# Altium schematic sheet SnapItBreakoutRev1.SchDoc: Snap It Breakout
size A; Author: Callum Neely; DrawnBy: Callum Neely; Revision: 1; SheetNumber: 2; SheetTotal: 2
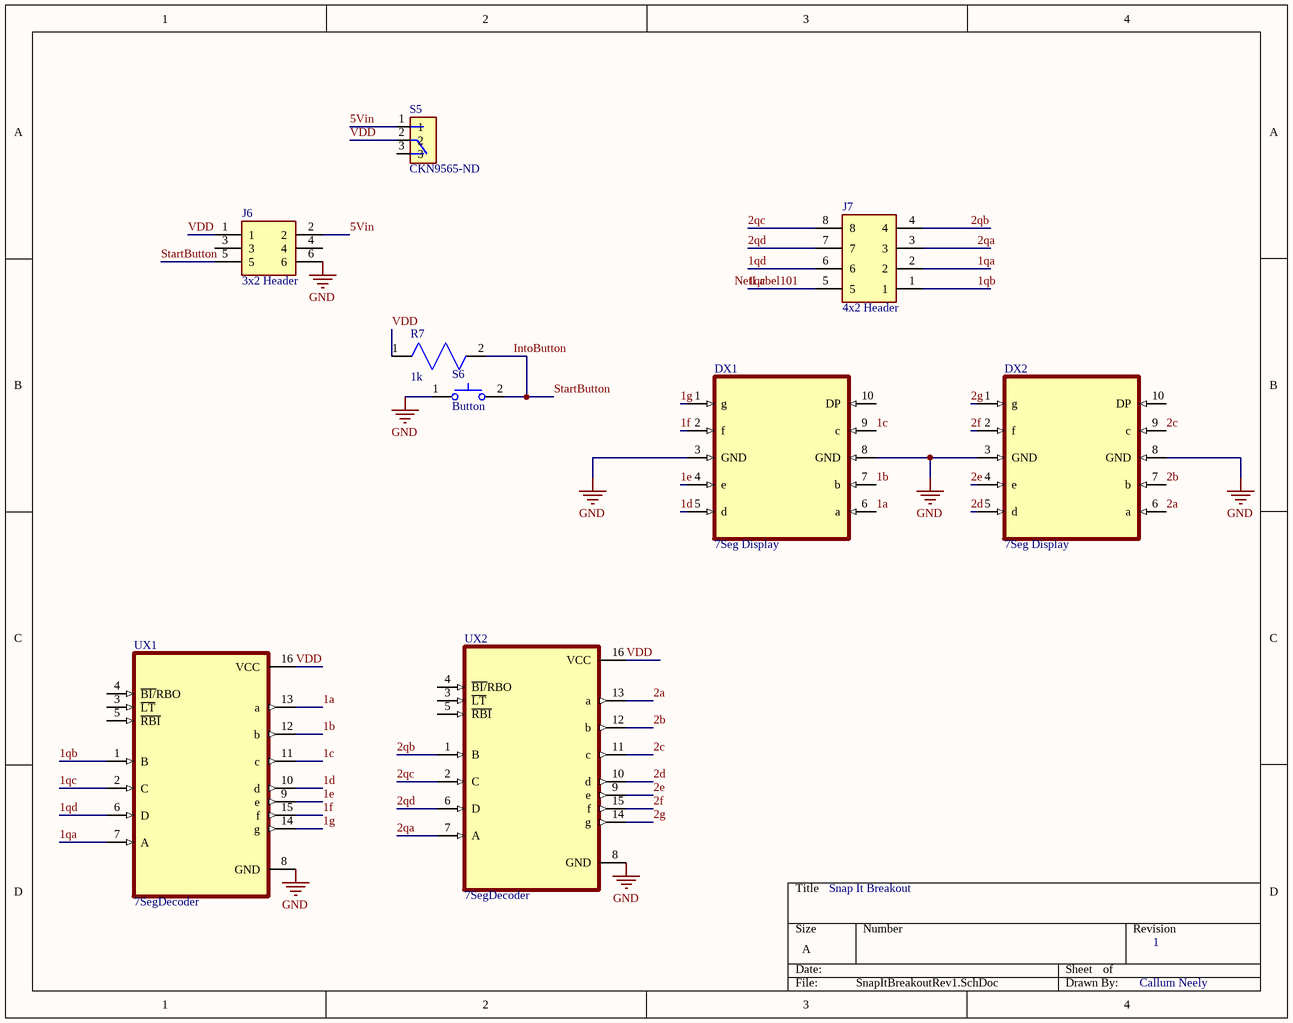
[diagram p0: SnapItBreakoutRev1.SchDoc]

## Parts
DX1  7Seg Display  [7 Seg]
DX2  7Seg Display  [7 Seg]
J6  3x2 Header  [3x2 Header]
J7  4x2 Header  [4x2 Header]
R7  1k  [0402Basic]
S5  CKN9565-ND  [Slide Switch]
S6  Button  [Pushbutton]
UX1  7SegDecoder  [DisplayDecoder]
UX2  7SegDecoder  [DisplayDecoder]

## Nets
GND: DX1.3(GND) DX1.8(GND) DX2.3(GND) DX2.8(GND) J6.6 S6.1(=name) UX1.8(GND) UX2.8(GND)
1a: DX1.6(a) UX1.13(a)
1b: DX1.7(b) UX1.12(b)
1c: DX1.9(c) UX1.11(c)
1d: DX1.5(d) UX1.10(d)
1e: DX1.4(e) UX1.9(e)
1f: DX1.2(f) UX1.15(f)
1g: DX1.1(g) UX1.14(g)
1qa: J7.2 UX1.7(A)
1qb: J7.1 UX1.1(B)
1qc: J7.5 UX1.2(C)
1qd: J7.6 UX1.6(D)
2a: DX2.6(a) UX2.13(a)
2b: DX2.7(b) UX2.12(b)
2c: DX2.9(c) UX2.11(c)
2d: DX2.5(d) UX2.10(d)
2e: DX2.4(e) UX2.9(e)
2f: DX2.2(f) UX2.15(f)
2g: DX2.1(g) UX2.14(g)
2qa: J7.3 UX2.7(A)
2qb: J7.4 UX2.1(B)
2qc: J7.8 UX2.2(C)
2qd: J7.7 UX2.6(D)
5Vin: J6.2 S5.1
IntoButton: J6.5 R7.2(=name) S6.2(=name)  [also labelled StartButton]
VDD: J6.1 R7.1(=name) S5.2 UX1.16(VCC) UX2.16(VCC)

Not connected (* = marked no-connect by the designer): DX1 10(DP); DX2 10(DP); J6 3 4; S5 3; UX1 3(~{LT}) 4(~{BI/}RBO) 5(~{RBI}); UX2 3(~{LT}) 4(~{BI/}RBO) 5(~{RBI})

## Notes on the sheet
- Labels drawn without touching a wire or pin: NetLabel101

## Library data of the parts
R7 = RES
S5 = Switch